# EAGLE schematic nintendo (EAGLE 7.7.0)
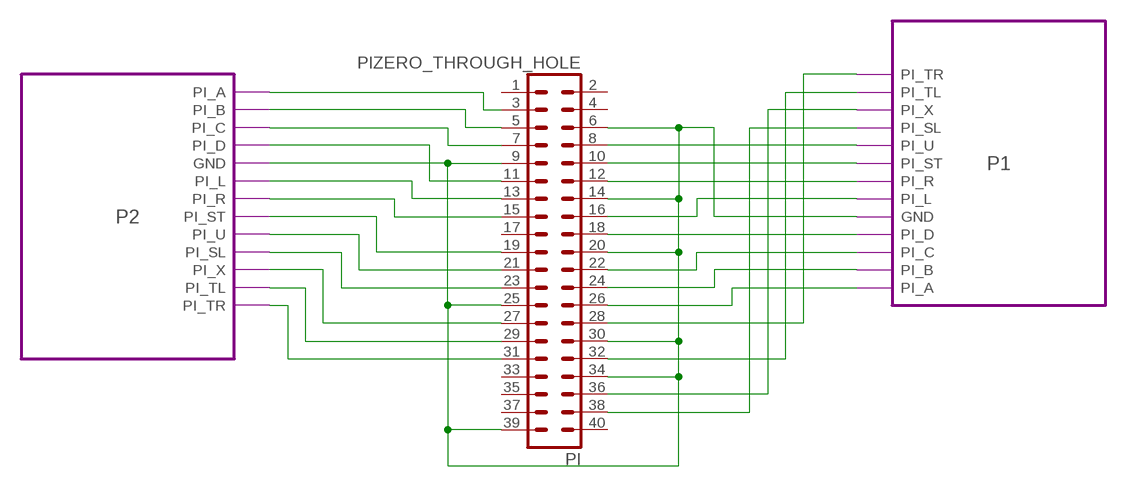
[diagram p0: schematic, sheet 1]

## Parts
PI  PIZERO_THROUGH_HOLE  [PIZERO_THOUGH_HOLE]

## Module instances
P1 = P
P2 = P

## Nets
N$1: PI.11 ; port P2.PI_D
N$2: PI.6 PI.9 PI.14 PI.20 PI.25 PI.30 PI.34 PI.39 ; port P1.GND P2.GND
N$3: PI.13 ; port P2.PI_L
N$4: PI.3 ; port P2.PI_A
N$5: PI.5 ; port P2.PI_B
N$6: PI.7 ; port P2.PI_C
N$7: PI.15 ; port P2.PI_R
N$8: PI.19 ; port P2.PI_ST
N$9: PI.21 ; port P2.PI_U
N$10: PI.8 ; port P1.PI_U
N$11: PI.10 ; port P1.PI_ST
N$12: PI.12 ; port P1.PI_R
N$13: PI.16 ; port P1.PI_L
N$14: PI.18 ; port P1.PI_D
N$15: PI.22 ; port P1.PI_C
N$16: PI.24 ; port P1.PI_B
N$17: PI.26 ; port P1.PI_A
N$18: PI.23 ; port P2.PI_SL
N$19: PI.27 ; port P2.PI_X
N$20: PI.29 ; port P2.PI_TL
N$21: PI.31 ; port P2.PI_TR
N$22: PI.38 ; port P1.PI_SL
N$23: PI.36 ; port P1.PI_X
N$24: PI.32 ; port P1.PI_TL
N$25: PI.28 ; port P1.PI_TR
Unconnected: PI.1 PI.2 PI.4 PI.17 PI.33 PI.35 PI.37 PI.40

## Library data of the parts
PI = pizero:PIZERO_THROUGH_HOLE

## Module P
Ports: PI_A(in) PI_B(in) PI_C(in) PI_D(in) PI_L(in) PI_R(in) PI_U(in) PI_SL(in) PI_ST(in) PI_X(in) PI_TL(in) PI_TR(in) GND(pwr)
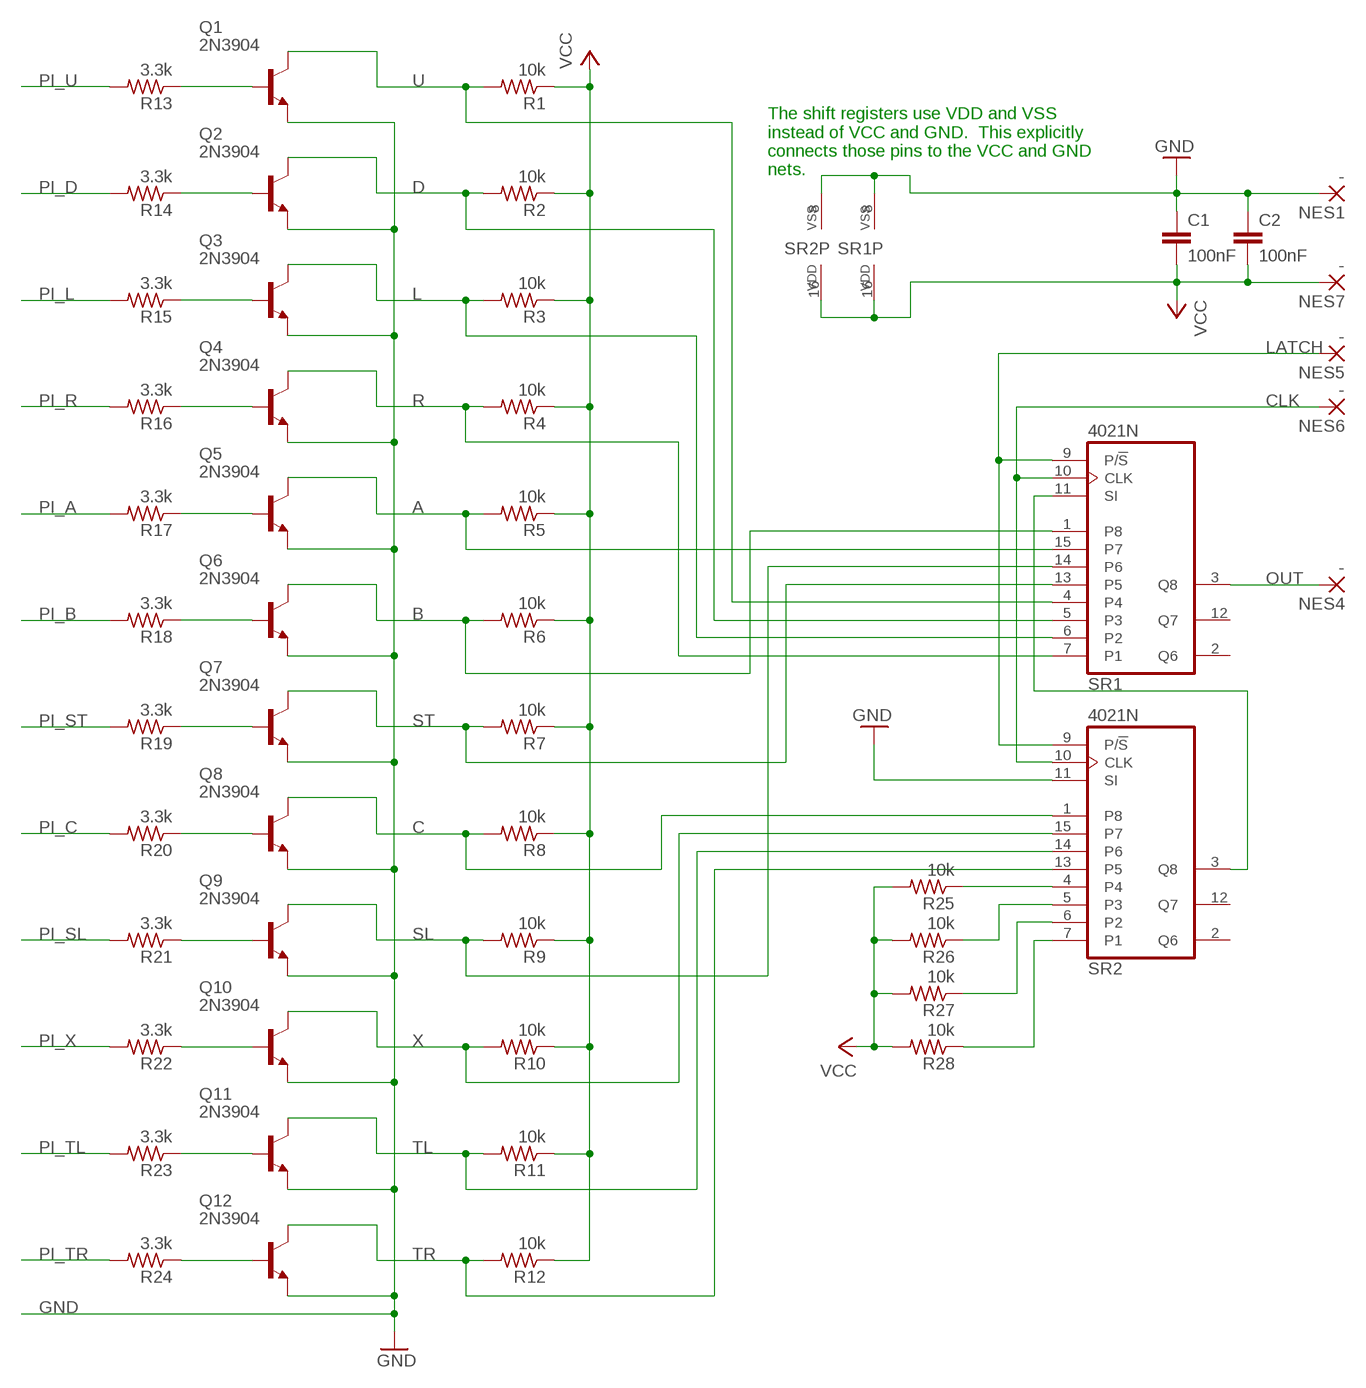
[diagram p1: schematic, module P, sheet 1]

### Parts
C1  100nF  C5/2.5  [C5B2.5]
C2  100nF  C5/2.5  [C5B2.5]
NES1  -  2,54/1,0  [2,54/1,0]
NES4  -  2,54/1,0  [2,54/1,0]
NES5  -  2,54/1,0  [2,54/1,0]
NES6  -  2,54/1,0  [2,54/1,0]
NES7  -  2,54/1,0  [2,54/1,0]
Q1  2N3904  [TO92]
Q2  2N3904  [TO92]
Q3  2N3904  [TO92]
Q4  2N3904  [TO92]
Q5  2N3904  [TO92]
Q6  2N3904  [TO92]
Q7  2N3904  [TO92]
Q8  2N3904  [TO92]
Q9  2N3904  [TO92]
Q10  2N3904  [TO92]
Q11  2N3904  [TO92]
Q12  2N3904  [TO92]
R1  10k  R-US_0207/10  [0207/10]
R2  10k  R-US_0207/10  [0207/10]
R3  10k  R-US_0207/10  [0207/10]
R4  10k  R-US_0207/10  [0207/10]
R5  10k  R-US_0207/10  [0207/10]
R6  10k  R-US_0207/10  [0207/10]
R7  10k  R-US_0207/10  [0207/10]
R8  10k  R-US_0207/10  [0207/10]
R9  10k  R-US_0207/10  [0207/10]
R10  10k  R-US_0207/10  [0207/10]
R11  10k  R-US_0207/10  [0207/10]
R12  10k  R-US_0207/10  [0207/10]
R13  3.3k  R-US_0207/10  [0207/10]
R14  3.3k  R-US_0207/10  [0207/10]
R15  3.3k  R-US_0207/10  [0207/10]
R16  3.3k  R-US_0207/10  [0207/10]
R17  3.3k  R-US_0207/10  [0207/10]
R18  3.3k  R-US_0207/10  [0207/10]
R19  3.3k  R-US_0207/10  [0207/10]
R20  3.3k  R-US_0207/10  [0207/10]
R21  3.3k  R-US_0207/10  [0207/10]
R22  3.3k  R-US_0207/10  [0207/10]
R23  3.3k  R-US_0207/10  [0207/10]
R24  3.3k  R-US_0207/10  [0207/10]
R25  10k  R-US_0207/10  [0207/10]
R26  10k  R-US_0207/10  [0207/10]
R27  10k  R-US_0207/10  [0207/10]
R28  10k  R-US_0207/10  [0207/10]
SR1  4021N  [DIL16]
SR2  4021N  [DIL16]

### Nets
A: Q5.1(C) R5.2 SR1.15(P7)
B: Q6.1(C) R6.2 SR1.1(P8)
C: Q8.1(C) R8.2 SR2.1(P8)
CLK: NES6.1(P) SR1.10(CLK) SR2.10(CLK)
D: Q2.1(C) R2.2 SR1.5(P3)
GND: C1.1 C2.1 NES1.1(P) Q1.3(E) Q2.3(E) Q3.3(E) Q4.3(E) Q5.3(E) Q6.3(E) Q7.3(E) Q8.3(E) Q9.3(E) Q10.3(E) Q11.3(E) Q12.3(E) SR1.8(VSS) SR2.8(VSS) SR2.11(SI)
L: Q3.1(C) R3.2 SR1.6(P2)
LATCH: NES5.1(P) SR1.9(P/!S) SR2.9(P/!S)
N$1: Q9.2(B) R21.1
N$2: Q1.2(B) R13.1
N$3: Q10.2(B) R22.1
N$4: Q11.2(B) R23.1
N$5: Q12.2(B) R24.1
N$9: Q2.2(B) R14.1
N$10: Q3.2(B) R15.1
N$11: Q4.2(B) R16.1
N$12: Q5.2(B) R17.1
N$13: Q6.2(B) R18.1
N$14: Q7.2(B) R19.1
N$15: Q8.2(B) R20.1
N$19: SR1.11(SI) SR2.3(Q8)
N$20: R25.1 SR2.4
N$21: R26.1 SR2.5(P3)
N$22: R27.1 SR2.6(P2)
N$23: R28.1 SR2.7(P1)
OUT: NES4.1(P) SR1.3(Q8)
PI_A: R17.2
PI_B: R18.2
PI_C: R20.2
PI_D: R14.2
PI_L: R15.2
PI_R: R16.2
PI_SL: R21.2
PI_ST: R19.2
PI_TL: R23.2
PI_TR: R24.2
PI_U: R13.2
PI_X: R22.2
R: Q4.1(C) R4.2 SR1.7(P1)
SL: Q9.1(C) R9.2 SR1.14(P6)
ST: Q7.1(C) R7.2 SR1.13(P5)
TL: Q11.1(C) R11.2 SR2.14(P6)
TR: Q12.1(C) R12.2 SR2.13(P5)
U: Q1.1(C) R1.2 SR1.4
VCC: C1.2 C2.2 NES7.1(P) R1.1 R2.1 R3.1 R4.1 R5.1 R6.1 R7.1 R8.1 R9.1 R10.1 R11.1 R12.1 R25.2 R26.2 R27.2 R28.2 SR1.16(VDD) SR2.16(VDD)
X: Q10.1(C) R10.2 SR2.15(P7)
Unconnected: SR1.2(Q6) SR1.12(Q7) SR2.2(Q6) SR2.12(Q7)

### Notes on the sheet
- The shift registers use VDD and VSS
  instead of VCC and GND.  This explicitly
  connects those pins to the VCC and GND
  nets.

### Library data of the parts
C1 C2 = capacitor-wima:C: CAPACITOR naming: grid - package width
NES1 NES4-NES7 = wirepad:2,54/1,0: THROUGH-HOLE PAD
Q1-Q12 = transistor-npn:2N3904: NPN Transistor
R1-R28 = resistor:R-US_: RESISTOR, American symbol
SR1 SR2 = 40xx:4021: 8-bit static SHIFT REGISTER